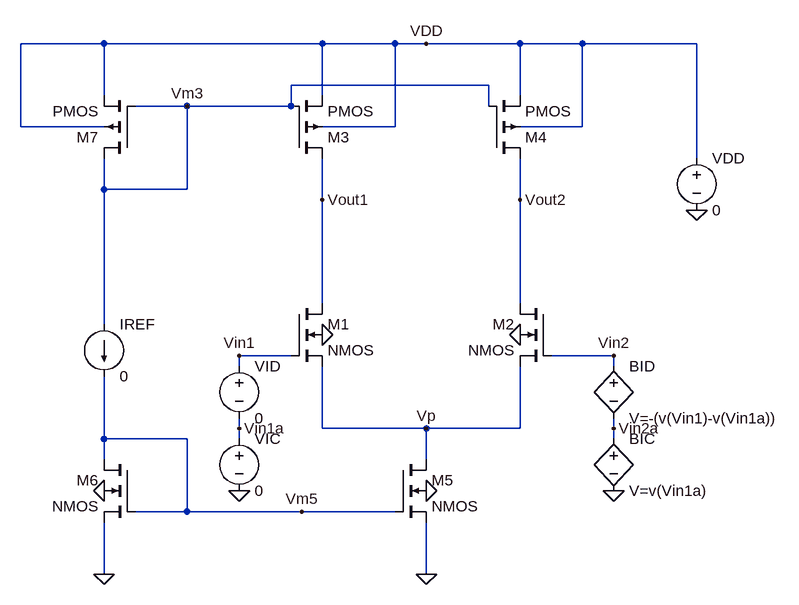
[diagram p0: schematic Chapter04B_02.fig.asc]
Chapter04B_02.fig.asc, the LTspice schematic file:
Version 4
SHEET 1 2940 740
WIRE -448 -592 -576 -592
WIRE -112 -592 -448 -592
WIRE 0 -592 -112 -592
WIRE 48 -592 0 -592
WIRE 192 -592 48 -592
WIRE 288 -592 192 -592
WIRE 464 -592 288 -592
WIRE 144 -528 -160 -528
WIRE -448 -512 -448 -592
WIRE -112 -512 -112 -592
WIRE 192 -512 192 -592
WIRE -320 -496 -400 -496
WIRE -160 -496 -160 -528
WIRE -160 -496 -320 -496
WIRE 144 -496 144 -528
WIRE -576 -464 -576 -592
WIRE -448 -464 -576 -464
WIRE 0 -464 0 -592
WIRE 0 -464 -112 -464
WIRE 288 -464 288 -592
WIRE 288 -464 192 -464
WIRE 464 -416 464 -592
WIRE -448 -368 -448 -416
WIRE -320 -368 -320 -496
WIRE -320 -368 -448 -368
WIRE -112 -352 -112 -416
WIRE 192 -352 192 -416
WIRE -112 -192 -112 -352
WIRE 192 -192 192 -352
WIRE -448 -160 -448 -368
WIRE -160 -112 -240 -112
WIRE 336 -112 240 -112
WIRE -240 -96 -240 -112
WIRE 336 -96 336 -112
WIRE -240 0 -240 -16
WIRE -112 0 -112 -96
WIRE 48 0 -112 0
WIRE 192 0 192 -96
WIRE 192 0 48 0
WIRE 336 0 336 -16
WIRE -448 16 -448 -80
WIRE -320 16 -448 16
WIRE -240 16 -240 0
WIRE 336 16 336 0
WIRE -448 48 -448 16
WIRE 48 48 48 0
WIRE -320 128 -320 16
WIRE -320 128 -400 128
WIRE -144 128 -320 128
WIRE 0 128 -144 128
WIRE -448 224 -448 144
WIRE 48 224 48 144
FLAG -448 224 0
FLAG 48 224 0
FLAG -448 96 0
FLAG -112 -144 0
FLAG 192 -144 0
FLAG 48 96 0
FLAG 464 -336 0
FLAG -240 96 0
FLAG 336 96 0
FLAG -240 -112 Vin1
FLAG -240 0 Vin1a
FLAG -112 -352 Vout1
FLAG 192 -352 Vout2
FLAG 48 0 Vp
FLAG 336 -112 Vin2
FLAG 336 0 Vin2a
FLAG 48 -592 VDD
FLAG -144 128 Vm5
FLAG -320 -496 Vm3
SYMBOL nmos4 -160 -192 R0
SYMATTR InstName M1
SYMBOL nmos4 240 -192 M0
SYMATTR InstName M2
SYMBOL nmos4 0 48 R0
SYMATTR InstName M5
SYMBOL nmos4 -400 48 M0
SYMATTR InstName M6
SYMBOL pmos4 -160 -416 M180
SYMATTR InstName M3
SYMBOL pmos4 144 -416 M180
SYMATTR InstName M4
SYMBOL voltage 464 -432 R0
WINDOW 123 0 0 Left 0
WINDOW 39 0 0 Left 0
SYMATTR InstName VDD
SYMATTR Value 0
SYMBOL current -448 -160 R0
WINDOW 123 0 0 Left 0
WINDOW 39 0 0 Left 0
SYMATTR InstName IREF
SYMATTR Value 0
SYMBOL voltage -240 0 R0
SYMATTR InstName VIC
SYMATTR Value 0
SYMBOL voltage -240 -112 R0
SYMATTR InstName VID
SYMATTR Value 0
SYMBOL bv 336 0 R0
SYMATTR InstName BIC
SYMATTR Value V=v(Vin1a)
SYMBOL bv 336 -112 R0
SYMATTR InstName BID
SYMATTR Value V=-(v(Vin1)-v(Vin1a))
SYMBOL pmos4 -400 -416 R180
SYMATTR InstName M7

The netlist it stands for:
* Chapter04B_02.fig.asc
M1 Vout1 Vin1 Vp 0 NMOS
M2 Vout2 Vin2 Vp 0 NMOS
M5 Vp Vm5 0 0 NMOS
M6 Vm5 Vm5 0 0 NMOS
M3 Vout1 Vm3 VDD VDD PMOS
M4 Vout2 Vm3 VDD VDD PMOS
VDD VDD 0 0
IREF Vm3 Vm5 0
VIC Vin1a 0 0
VID Vin1 Vin1a 0
BIC Vin2a 0 V=v(Vin1a)
BID Vin2 Vin2a V=-(v(Vin1)-v(Vin1a))
M7 Vm3 Vm3 VDD VDD PMOS
.model NMOS NMOS
.model PMOS PMOS
.lib standard.mos
.backanno
.end